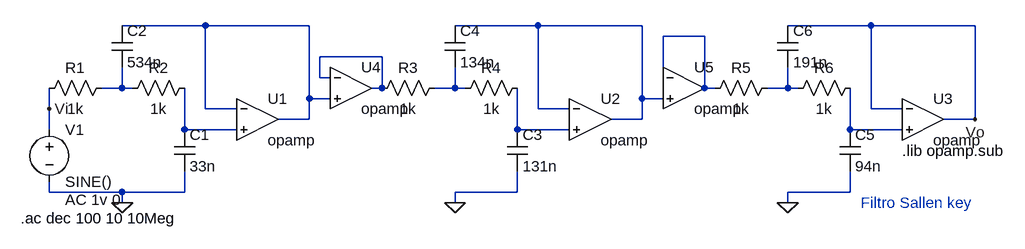
[diagram p0: schematic TP2_3_1.asc]
TP2_3_1.asc, the LTspice schematic file:
Version 4
SHEET 1 1676 680
WIRE 432 0 304 0
WIRE 592 0 432 0
WIRE 944 0 816 0
WIRE 1104 0 944 0
WIRE 1456 0 1328 0
WIRE 1616 0 1456 0
WIRE 1200 16 1136 16
WIRE 704 48 608 48
WIRE 608 80 608 48
WIRE 624 80 608 80
WIRE 1136 80 1136 16
WIRE 304 96 304 64
WIRE 304 96 272 96
WIRE 320 96 304 96
WIRE 704 96 704 48
WIRE 704 96 688 96
WIRE 816 96 816 64
WIRE 816 96 784 96
WIRE 832 96 816 96
WIRE 1200 96 1200 16
WIRE 1216 96 1200 96
WIRE 1328 96 1328 64
WIRE 1328 96 1296 96
WIRE 1344 96 1328 96
WIRE 592 112 592 0
WIRE 624 112 592 112
WIRE 1104 112 1104 0
WIRE 1136 112 1104 112
WIRE 192 128 192 96
WIRE 432 128 432 0
WIRE 480 128 432 128
WIRE 944 128 944 0
WIRE 992 128 944 128
WIRE 1456 128 1456 0
WIRE 1504 128 1456 128
WIRE 592 144 592 112
WIRE 592 144 544 144
WIRE 1104 144 1104 112
WIRE 1104 144 1056 144
WIRE 1616 144 1616 0
WIRE 1616 144 1568 144
WIRE 192 160 192 128
WIRE 400 160 400 96
WIRE 480 160 400 160
WIRE 912 160 912 96
WIRE 992 160 912 160
WIRE 1424 160 1424 96
WIRE 1504 160 1424 160
WIRE 192 256 192 240
WIRE 304 256 192 256
WIRE 400 256 400 224
WIRE 400 256 304 256
WIRE 912 256 912 224
WIRE 912 256 816 256
WIRE 1424 256 1424 224
WIRE 1424 256 1328 256
WIRE 304 272 304 256
WIRE 816 272 816 256
WIRE 1328 272 1328 256
FLAG 304 272 0
FLAG 192 128 Vi
FLAG 816 272 0
FLAG 1328 272 0
FLAG 1616 144 Vo
SYMBOL Opamps\\opamp 512 80 R0
SYMATTR InstName U1
SYMBOL voltage 192 144 R0
WINDOW 123 24 124 Left 2
WINDOW 39 0 0 Left 0
SYMATTR InstName V1
SYMATTR Value SINE()
SYMATTR Value2 AC 1v 0
SYMBOL res 288 80 R90
WINDOW 0 0 56 VBottom 2
WINDOW 3 32 56 VTop 2
SYMATTR InstName R1
SYMATTR Value 1k
SYMBOL res 416 80 R90
WINDOW 0 0 56 VBottom 2
WINDOW 3 32 56 VTop 2
SYMATTR InstName R2
SYMATTR Value 1k
SYMBOL cap 384 160 R0
SYMATTR InstName C1
SYMATTR Value 33n
SYMBOL cap 288 0 R0
SYMATTR InstName C2
SYMATTR Value 534n
SYMBOL Opamps\\opamp 1024 80 R0
SYMATTR InstName U2
SYMBOL res 800 80 R90
WINDOW 0 0 56 VBottom 2
WINDOW 3 32 56 VTop 2
SYMATTR InstName R3
SYMATTR Value 1k
SYMBOL res 928 80 R90
WINDOW 0 0 56 VBottom 2
WINDOW 3 32 56 VTop 2
SYMATTR InstName R4
SYMATTR Value 1k
SYMBOL cap 896 160 R0
SYMATTR InstName C3
SYMATTR Value 131n
SYMBOL cap 800 0 R0
SYMATTR InstName C4
SYMATTR Value 134n
SYMBOL Opamps\\opamp 1536 80 R0
SYMATTR InstName U3
SYMBOL res 1312 80 R90
WINDOW 0 0 56 VBottom 2
WINDOW 3 32 56 VTop 2
SYMATTR InstName R5
SYMATTR Value 1k
SYMBOL res 1440 80 R90
WINDOW 0 0 56 VBottom 2
WINDOW 3 32 56 VTop 2
SYMATTR InstName R6
SYMATTR Value 1k
SYMBOL cap 1408 160 R0
SYMATTR InstName C5
SYMATTR Value 94n
SYMBOL cap 1312 0 R0
SYMATTR InstName C6
SYMATTR Value 191n
SYMBOL Opamps\\opamp 656 32 R0
SYMATTR InstName U4
SYMBOL Opamps\\opamp 1168 32 R0
SYMATTR InstName U5
TEXT 1504 192 Left 2 !.lib opamp.sub
TEXT 1440 272 Left 2 ;Filtro Sallen key
TEXT 148 296 Left 2 !.ac dec 100 10 10Meg

The netlist it stands for:
* TP2_3_1.asc
XU1 N001 N008 N001 opamp Aol=100K GBW=10Meg  ; pins invin noninvin out
V1 Vi 0 SINE() AC 1v 0
R1 N005 Vi 1k
R2 N008 N005 1k
C1 N008 0 33n
C2 N001 N005 534n
XU2 N002 N009 N002 opamp Aol=100K GBW=10Meg  ; pins invin noninvin out
R3 N006 N004 1k
R4 N009 N006 1k
C3 N009 0 131n
C4 N002 N006 134n
XU3 Vo N010 Vo opamp Aol=100K GBW=10Meg  ; pins invin noninvin out
R5 N007 N003 1k
R6 N010 N007 1k
C5 N010 0 94n
C6 Vo N007 191n
XU4 N004 N001 N004 opamp Aol=100K GBW=10Meg  ; pins invin noninvin out
XU5 N003 N002 N003 opamp Aol=100K GBW=10Meg  ; pins invin noninvin out
.lib opamp.sub
* Filtro Sallen key
.ac dec 100 10 10Meg
.backanno
.end